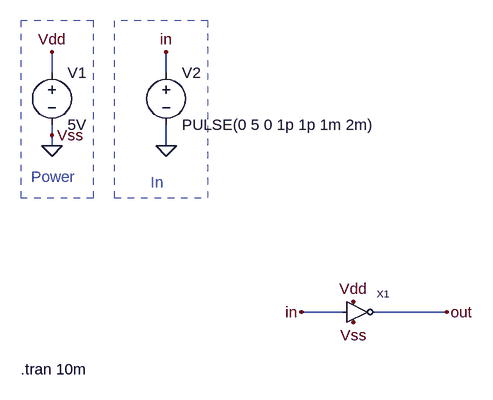
[diagram p0: schematic not_block.asc]
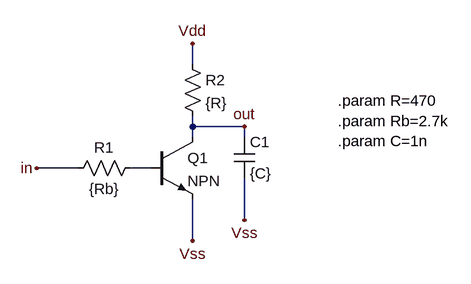
[diagram p1: sub-circuit not.asc]
not_block.asc, the LTspice schematic file:
Version 4
SHEET 1 880 680
WIRE -560 -416 -560 -448
WIRE -384 -416 -384 -448
WIRE -560 -320 -560 -336
WIRE -560 -304 -560 -320
WIRE -384 -304 -384 -336
WIRE -112 -48 -176 -48
WIRE 48 -48 -64 -48
FLAG 48 -48 out
FLAG -176 -48 in
FLAG -560 -304 0
FLAG -384 -304 0
FLAG -384 -448 in
FLAG -560 -448 Vdd
FLAG -560 -320 Vss
FLAG -96 -64 Vdd
FLAG -96 -32 Vss
SYMBOL voltage -560 -432 R0
WINDOW 123 0 0 Left 0
WINDOW 39 0 0 Left 0
SYMATTR InstName V1
SYMATTR Value 5V
SYMBOL voltage -384 -432 R0
WINDOW 123 0 0 Left 0
WINDOW 39 0 0 Left 0
SYMATTR InstName V2
SYMATTR Value PULSE(0 5 0 1p 1p 1m 2m)
SYMBOL not -112 -48 R0
SYMATTR InstName X1
TEXT -592 -256 Left 2 ;Power
TEXT -408 -248 Left 2 ;In
TEXT -608 40 Left 2 !.tran 10m
RECTANGLE Normal -496 -496 -608 -224 2
RECTANGLE Normal -320 -496 -464 -224 2

not.asc, the sub-circuit schematic file:
Version 4
SHEET 1 880 680
WIRE -96 -240 -96 -272
WIRE -96 -144 -96 -160
WIRE -16 -144 -96 -144
WIRE -96 -128 -96 -144
WIRE -16 -128 -16 -144
WIRE -272 -80 -336 -80
WIRE -160 -80 -192 -80
WIRE -16 0 -16 -64
WIRE -96 32 -96 -32
FLAG -16 -144 out
FLAG -336 -80 in
FLAG -96 32 Vss
FLAG -96 -272 Vdd
FLAG -16 0 Vss
SYMBOL npn -160 -128 R0
SYMATTR InstName Q1
SYMBOL res -176 -96 R90
WINDOW 0 0 56 VBottom 2
WINDOW 3 32 56 VTop 2
SYMATTR InstName R1
SYMATTR Value {Rb}
SYMBOL res -112 -256 R0
SYMATTR InstName R2
SYMATTR Value {R}
SYMBOL cap -32 -128 R0
SYMATTR InstName C1
SYMATTR Value {C}
TEXT 128 -184 Left 2 !.param R=470\n.param Rb=2.7k\n.param C=1n

The netlist it stands for:
* not_block.asc
V1 Vdd 0 5V
V2 in 0 PULSE(0 5 0 1p 1p 1m 2m)
XX1 in out Vdd 0 not

* block symbol definitions
.subckt not in out Vdd Vss
Q1 out N001 Vss 0 NPN
R1 N001 in {Rb}
R2 Vdd out {R}
C1 out Vss {C}
.param R=470
.param Rb=2.7k
.param C=1n
.ends not

.model NPN NPN
.model PNP PNP
.lib standard.bjt
* Power
* In
.tran 10m
.backanno
.end

* Results of the author's LTspice run, read from the files saved beside the schematic
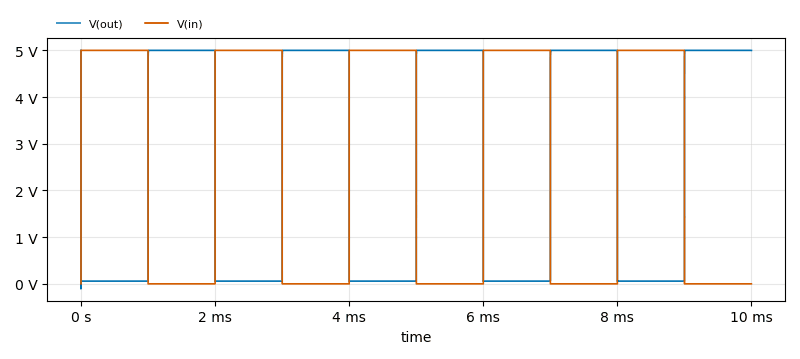
[diagram p2: Transient Analysis of not_block.asc, plotted from the saved traces]
* Transient Analysis, 1 run:
*   V(out): min -106.4 mV, max 5 V, average 2.528 V, rms 3.534 V, last 5 V
*   V(in): min 0 V, max 5 V, average 2.5 V, rms 3.536 V, last 0 V